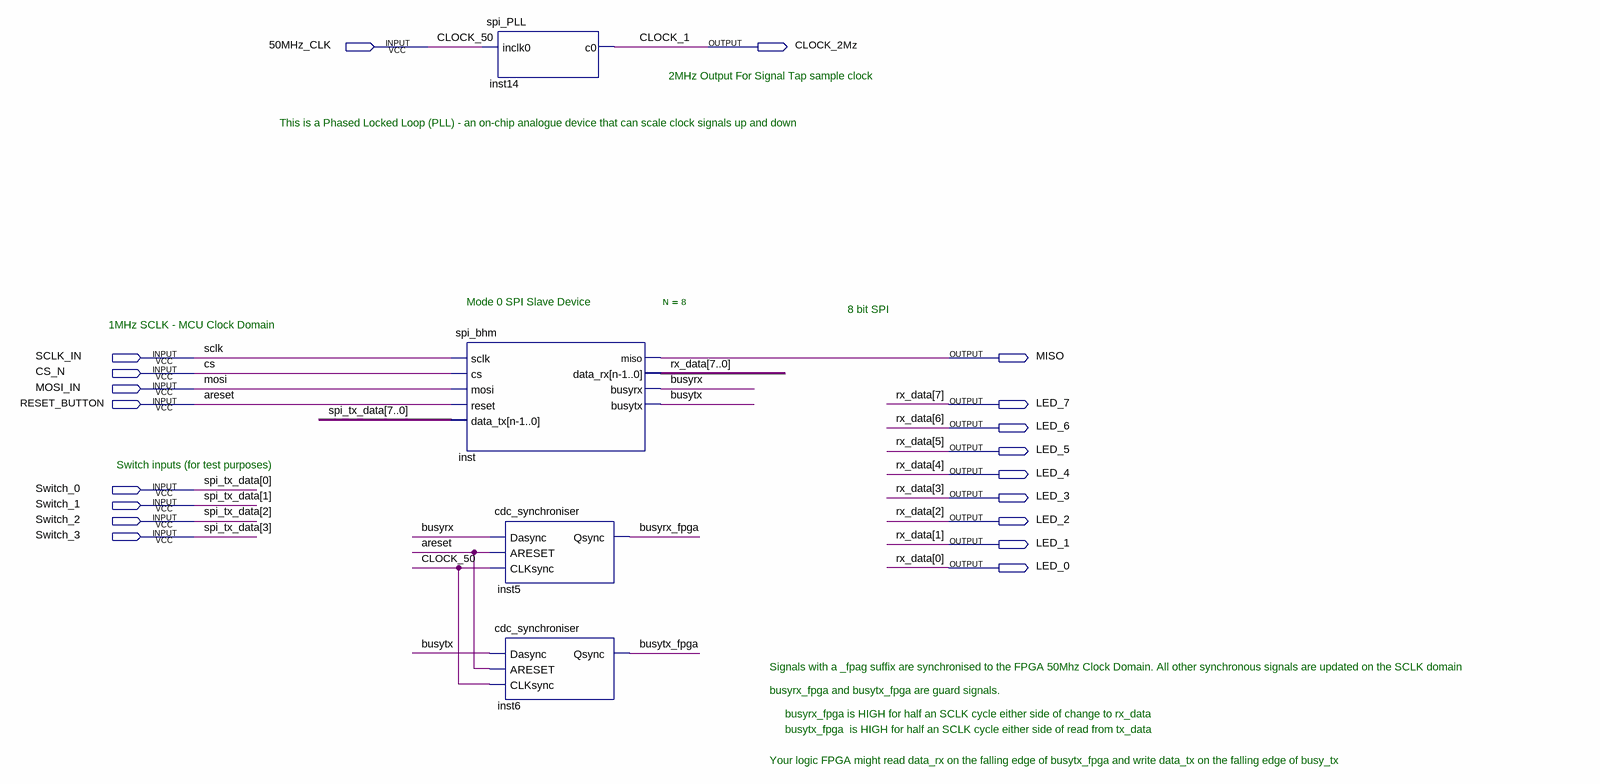
[diagram p0: schematic sheet]
// Quartus schematic spi_test.bdf as structural Verilog: 4 symbols, 19 pins
module spi_test (
  input  \50MHz_CLK ,
  input  SCLK_IN,
  input  CS_N,
  input  MOSI_IN,
  input  RESET_BUTTON,
  input  Switch_0,
  input  Switch_1,
  input  Switch_2,
  input  Switch_3,
  output CLOCK_2Mz,
  output MISO,
  output LED_7,
  output LED_6,
  output LED_5,
  output LED_4,
  output LED_3,
  output LED_2,
  output LED_1,
  output LED_0
);

  wire busyrx, busyrx_fpga, busytx, busytx_fpga;
  wire [7:4] spi_tx_data;

  spi_PLL inst14 (.inclk0(\50MHz_CLK ), .c0(CLOCK_2Mz));
  spi_bhm #(.N(8)) inst (
    .sclk(SCLK_IN), .cs(CS_N), .mosi(MOSI_IN), .reset(RESET_BUTTON),
    .data_tx({spi_tx_data, Switch_3, Switch_2, Switch_1, Switch_0}), .miso(MISO),
    .data_rx({LED_7, LED_6, LED_5, LED_4, LED_3, LED_2, LED_1, LED_0}), .busyrx(busyrx), .busytx(busytx));
  cdc_synchroniser inst5 (.Dasync(busyrx), .ARESET(RESET_BUTTON), .CLKsync(\50MHz_CLK ), .Qsync(busyrx_fpga));
  cdc_synchroniser inst6 (.Dasync(busytx), .ARESET(RESET_BUTTON), .CLKsync(\50MHz_CLK ), .Qsync(busytx_fpga));

  // Other names for the same wires on the sheet: areset = RESET_BUTTON; CLOCK_1 = CLOCK_2Mz; CLOCK_50 = \50MHz_CLK ;
  //   cs = CS_N; mosi = MOSI_IN; rx_data[7:0] = {LED_7, LED_6, LED_5, LED_4, LED_3, LED_2, LED_1, LED_0};
  //   sclk = SCLK_IN; spi_tx_data[3:0] = {Switch_3, Switch_2, Switch_1, Switch_0}

  // Notes on the sheet:
  //   2MHz Output For Signal Tap sample clock
  //   This is a Phased Locked Loop (PLL) - an on-chip analogue device that can scale clock signals up and down
  //   Mode 0 SPI Slave Device
  //   8 bit SPI
  //   1MHz SCLK - MCU Clock Domain
  //   Switch inputs (for test purposes)
  //   Signals with a _fpag suffix are synchronised to the FPGA 50Mhz Clock Domain. All other synchronous signals are updated on the SCLK domain 
  //   busyrx_fpga and busytx_fpga are guard signals.
  //   busyrx_fpga is HIGH for half an SCLK cycle either side of change to rx_data
  //   busytx_fpga  is HIGH for half an SCLK cycle either side of read from tx_data
  //   Your logic FPGA might read data_rx on the falling edge of busytx_fpga and write data_tx on the falling edge of busy_tx
endmodule
